# Altium schematic sheet 1-Block-diagram.SchDoc: Thermocouple Temperature Logger
size A4; Date: 14.03.2026; Author: MG & JK; Revision: 1-0; SheetNumber: 1; SheetTotal: 7; Model: Rev 1.0; PageSetup: Record=PageOptions|CenterHorizontal=True|CenterVertical=True|PrintScale=0.52|XCorrection=1.00|YCorrection=1.00|PrintKind=1|BorderSize=5000000|LeftOffset=0|BottomOffset=0|Orientation=2|PaperLength=4200|PaperWidth=2970|Scale=100|PaperSource=7|PrintQuality=600|MediaType=1|DitherType=10|PaperKind=A3|PrintScaleMode=1
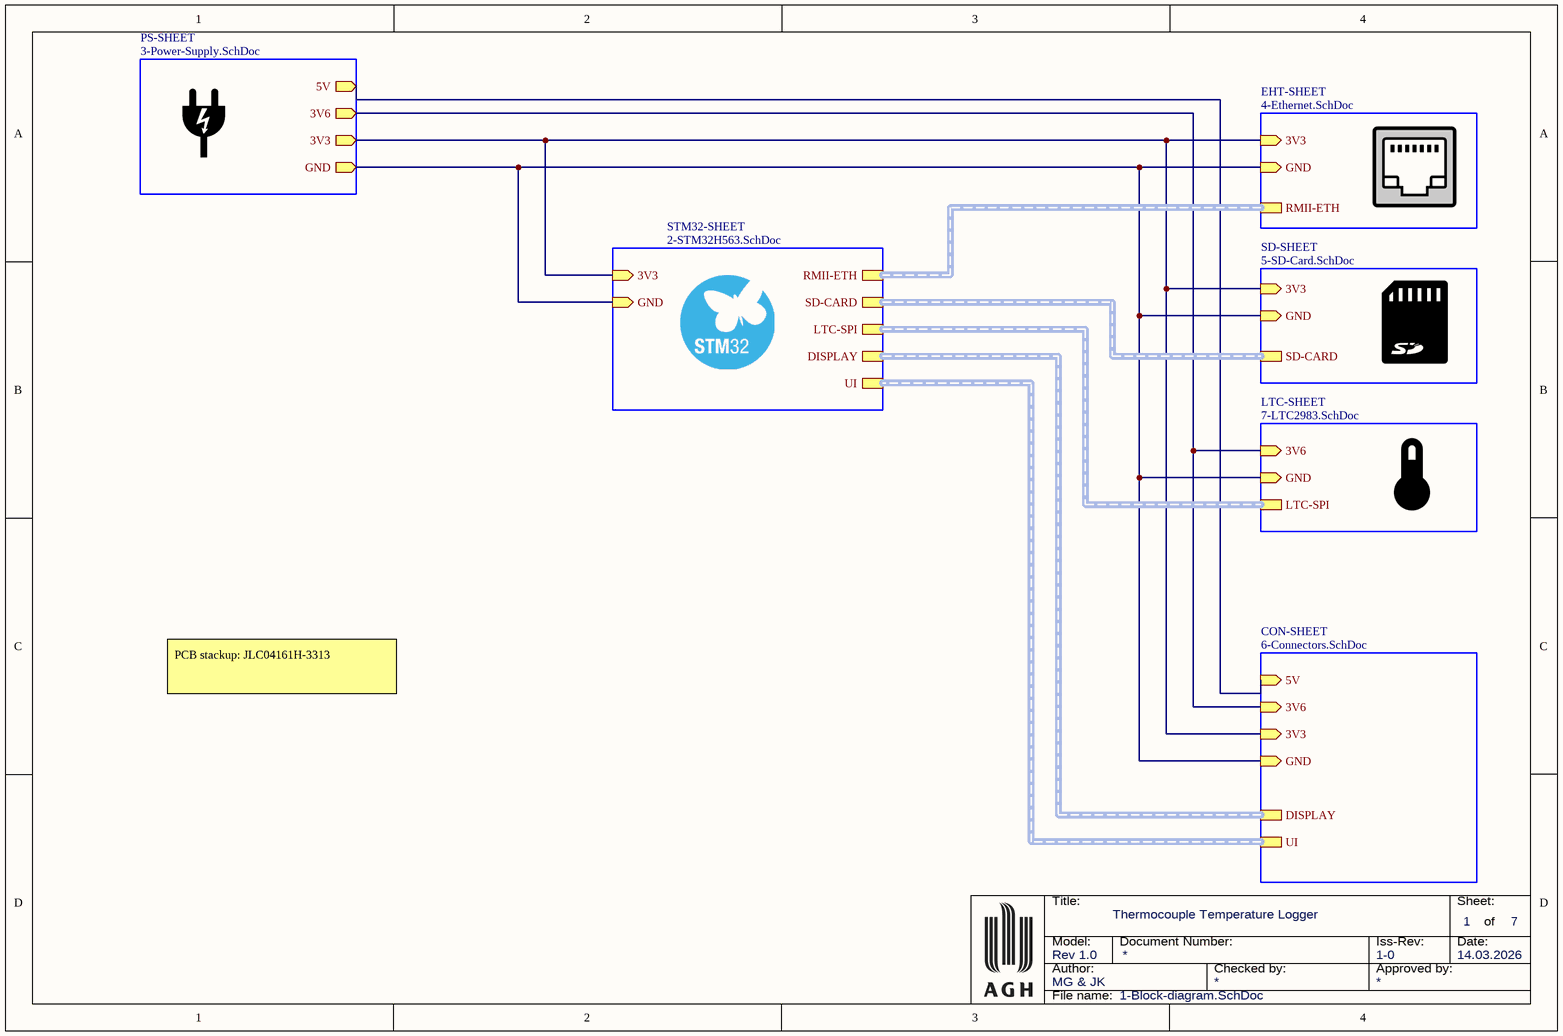
[diagram p0: 1-Block-diagram.SchDoc]

## Sub-sheets
CON-SHEET = 6-Connectors.SchDoc: 3V3 (in), 3V6 (in), 5V (in), GND (in), DISPLAY (harness DISPLAY), UI (harness USER_INTERFACE)
EHT-SHEET = 4-Ethernet.SchDoc: RMII-ETH (harness RMII-ETH), 3V3 (in), GND (in)
LTC-SHEET = 7-LTC2983.SchDoc: LTC-SPI (harness LTC2983), 3V6 (in), GND (in)
PS-SHEET = 3-Power-Supply.SchDoc: 5V (out), 3V6 (out), 3V3 (out), GND (out)
SD-SHEET = 5-SD-Card.SchDoc: SD-CARD (harness SD), 3V3 (in), GND (in)
STM32-SHEET = 2-STM32H563.SchDoc: SD-CARD (harness SD), RMII-ETH (harness RMII-ETH), 3V3 (in), GND (in), LTC-SPI (harness LTC2983), DISPLAY (harness DISPLAY), UI (harness USER_INTERFACE)

## Nets
(unnamed): sheet STM32-SHEET/3V3, sheet PS-SHEET/3V3, sheet EHT-SHEET/3V3, sheet SD-SHEET/3V3, sheet CON-SHEET/3V3
(unnamed): sheet STM32-SHEET/GND, sheet PS-SHEET/GND, sheet EHT-SHEET/GND, sheet SD-SHEET/GND, sheet CON-SHEET/GND, sheet LTC-SHEET/GND
(unnamed): sheet PS-SHEET/5V, sheet CON-SHEET/5V
(unnamed): sheet PS-SHEET/3V6, sheet CON-SHEET/3V6, sheet LTC-SHEET/3V6

## Buses and harness runs
harness sheet CON-SHEET/DISPLAY = sheet STM32-SHEET/DISPLAY
harness sheet CON-SHEET/UI = sheet STM32-SHEET/UI
harness sheet EHT-SHEET/RMII-ETH = sheet STM32-SHEET/RMII-ETH
harness sheet LTC-SHEET/LTC-SPI = sheet STM32-SHEET/LTC-SPI
harness sheet SD-SHEET/SD-CARD = sheet STM32-SHEET/SD-CARD

## Notes on the sheet
- PCB stackup: JLC04161H-3313
- Title:
- Sheet:
- of
- Author:
- Model:
- Document Number:
- Checked by:
- Iss-Rev:
- Approved by:
- Date:
- File name: